# EAGLE design lightboxschematicv2 (EAGLE 9.2.0)
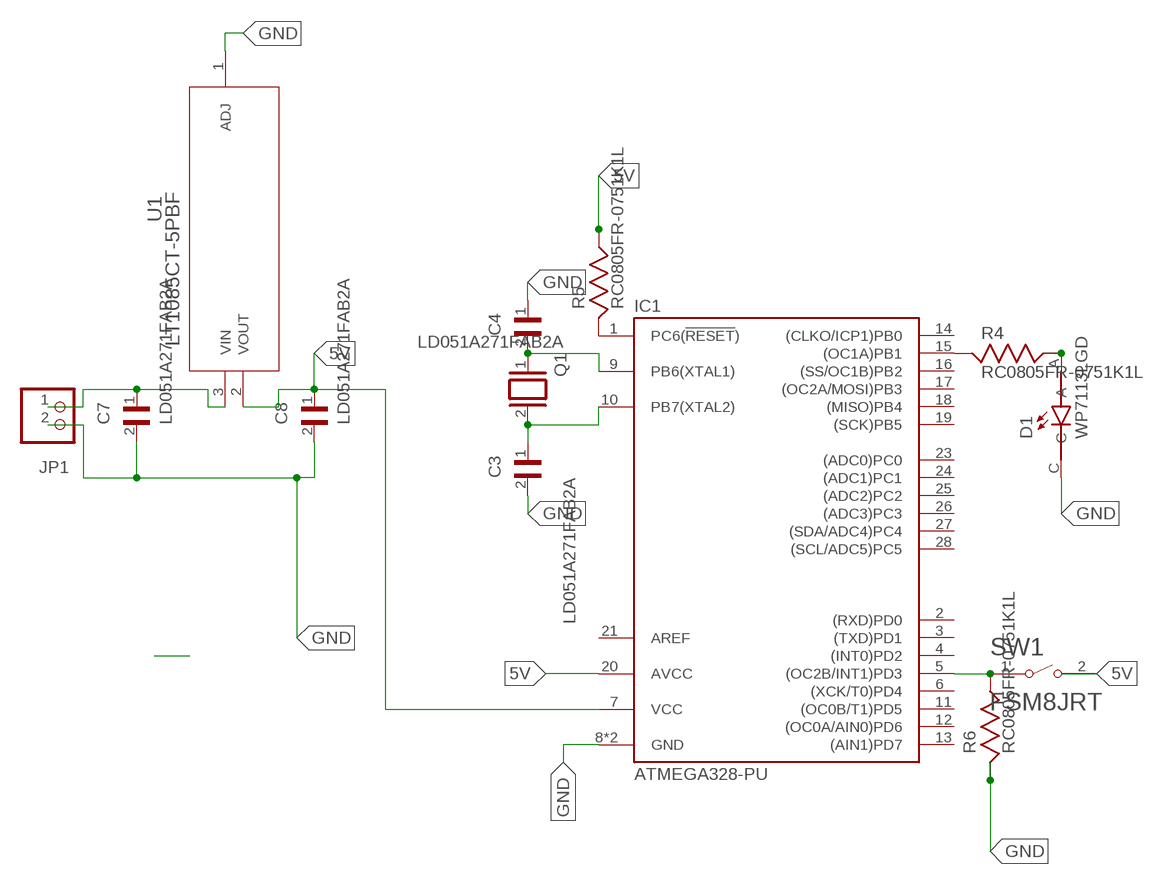
[diagram p0: schematic, sheet 1]

## Parts
C3  LD051A271FAB2A  [CAPC2012X140N]
C4  LD051A271FAB2A  [CAPC2012X140N]
C7  LD051A271FAB2A  [CAPC2012X140N]
C8  LD051A271FAB2A  [CAPC2012X140N]
D1  WP7113LGD  [LED_WP7113LGD]
IC1  ATMEGA328-PU  [DIL28]
JP1  PINHD-1X2  [1X02]
Q1  XTAL/S  [QS]
R4  RC0805FR-0751K1L  [RESC2012X60]
R5  RC0805FR-0751K1L  [RESC2012X60]
R6  RC0805FR-0751K1L  [RESC2012X60]
SW1  FSM8JRT  [TE_FSM8JRT]
U1  LT1085CT-5PBF  [TO220-3_T]

## Nets
5V: C8.1 IC1.7(VCC) IC1.20(AVCC) R5.2 SW1.2 U1.2(VOUT)
GND: C3.2 C4.1 C7.2 C8.2 D1.C IC1.8(GND) IC1.11((OC0B/T1)PD5) IC1.22(GND) JP1.2 R6.1 U1.1(ADJ)
N$1: IC1.1(PC6(!RESET!)) R5.1
N$2: D1.A R4.2
N$3: C7.1 JP1.1 U1.3(VIN)
N$4: IC1.5((OC2B/INT1)PD3) R6.2 SW1.1
N$5: IC1.15((OC1A)PB1) R4.1
N$6: C4.2 IC1.9(PB6(XTAL1)) Q1.1
N$7: C3.1 IC1.10(PB7(XTAL2)) Q1.2
Unconnected: IC1.2((RXD)PD0) IC1.3((TXD)PD1) IC1.4((INT0)PD2) IC1.6((XCK/T0)PD4) IC1.12((OC0A/AIN0)PD6) IC1.13((AIN1)PD7) IC1.14((CLKO/ICP1)PB0) IC1.16((SS/OC1B)PB2) IC1.17((OC2A/MOSI)PB3) IC1.18((MISO)PB4) IC1.19((SCK)PB5) IC1.21(AREF) IC1.23((ADC0)PC0) IC1.24((ADC1)PC1) IC1.25((ADC2)PC2) IC1.26((ADC3)PC3) IC1.27((SDA/ADC4)PC4) IC1.28((SCL/ADC5)PC5)

## Library data of the parts
C3 C4 C7 C8 = LD051A271FAB2A:LD051A271FAB2A: CAP CER 270PF 100V NP0 0805; AVAILABILITY: Unavailable; DESCRIPTION: Cap Ceramic 270pF 100V C0G 1% SMD 0805 125°C Paper T/R; MF: AVX; MP: LD051A271FAB2A; PACKAGE: 0805 AVX; PRICE: None
D1 = WP7113LGD:WP7113LGD: LED; Thru-Hole; Green; T1-3/4; 5mm; Clear Lens; 25ma; 565nm; 200mcd; Round; DESCRIPTION: LED; Thru-Hole; Green; T1-3/4; 5mm; Green Lens; 25mA; 565 nm; 2 mcd; Round; DIGI-KEY_PART_NUMBER: 754-1265-ND; DIGI-KEY_PURCHASE_URL: https://www.digikey.com/product-detail/en/kingbright/WP7113LGD/754-1265-ND/1747664?utm_source=snapeda&utm_medium=aggregator&utm_campaign=symbol; MF: Kingbright; MP: WP7113LGD; PACKAGE: Radial Kingbright
IC1 = ATMEGA328DIP-PU:ATMEGA328-PU: Atmel ATmega48/88/168/328 AVR Microcontroller; DESCRIPTION: ATmega Series 20 MHz 32 KB Flash 2 KB SRAM 8-Bit Microcontroller - DIP-28; DIGI-KEY_PART_NUMBER: ATMEGA328-PU-ND; DIGI-KEY_PURCHASE_URL: https://www.digikey.com/product-detail/en/microchip-technology/ATMEGA328-PU/ATMEGA328-PU-ND/2271026?utm_source=snapeda&utm_medium=aggregator&utm_campaign=symbol; MF: Microchip; MP: ATMEGA328-PU; PACKAGE: PDIP-28 Microchip
JP1 = pinhead:PINHD-1X2: PIN HEADER
Q1 = special:XTAL/S: CRYSTAL
R4-R6 = RC0805FR-0751K1L:RC0805FR-0751K1L: RC Series 0805 0.125 W 2 kOhms 5% ±100 ppm/°C SMT Thick Film Chip Resistor; DESCRIPTION: Res Thick Film 2.0 x 1.2 mm 51.1K Ohm 1% 0.125W_1/8W_ 100ppm/ C Molded SMD Paper T/R; DIGI-KEY_PART_NUMBER: 311-51.1KCRCT-ND; DIGI-KEY_PURCHASE_URL: https://www.digikey.com/product-detail/en/yageo/RC0805FR-0751K1L/311-51.1KCRCT-ND/730962?utm_source=snapeda&utm_medium=aggregator&utm_campaign=symbol; MF: Yageo; MP: RC0805FR-0751K1L; PACKAGE: 0805 Yageo
SW1 = FSM8JRT:FSM8JRT: Tactile Switches PUSHBUTTON SWITCH TACT; COMMENT: 147694-1; CONFIGURATION_POLE-THROW: Single Pole - Single Throw; CONTACT_CURRENT_RATING: 50 mA; DESCRIPTION: FSM8JRT=SWITCH,PUSHBUTTON,TACT; DIGI-KEY_PART_NUMBER: 450-2039-1-ND; DIGI-KEY_PURCHASE_URL: https://www.digikey.com/product-detail/en/te-connectivity-alcoswitch-switches/FSM8JRT/450-2039-1-ND/4146916?utm_source=snapeda&utm_medium=aggregator&utm_campaign=symbol; EU_ROHS_COMPLIANCE: Compliant; MF: TE Connectivity; MP: FSM8JRT; PACKAGE: None; TE_PURCHASE_URL: https://www.te.com/usa-en/product-147694-1.html?te_bu=Cor&te_type=disp&te_campaign=seda_glo_cor-seda-global-disp-prtnr-fy19-seda-model-bom-cta_sma-317_1&elqCampaignId=32493
U1 = VOLTAGEREGULATORNEW:LT1085CT-5PBF; MANUFACTURER_PART_NUMBER: LT1085CT5#PBF; VENDOR: Linear Technology

## Net classes
0 default: width 0.305 mm, drill 0.508 mm, clearance 0.305 mm

## Board
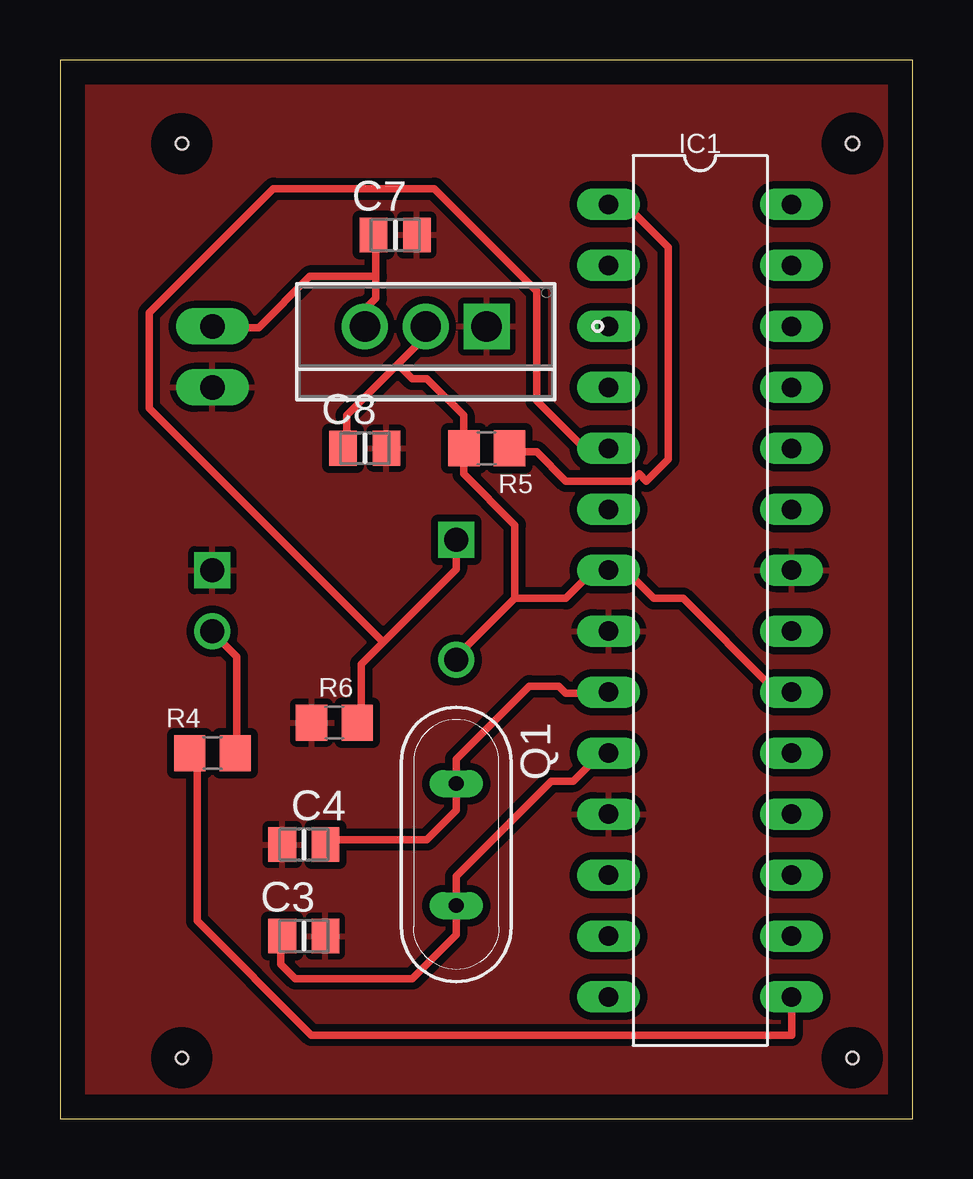
[diagram p1: board, top side]
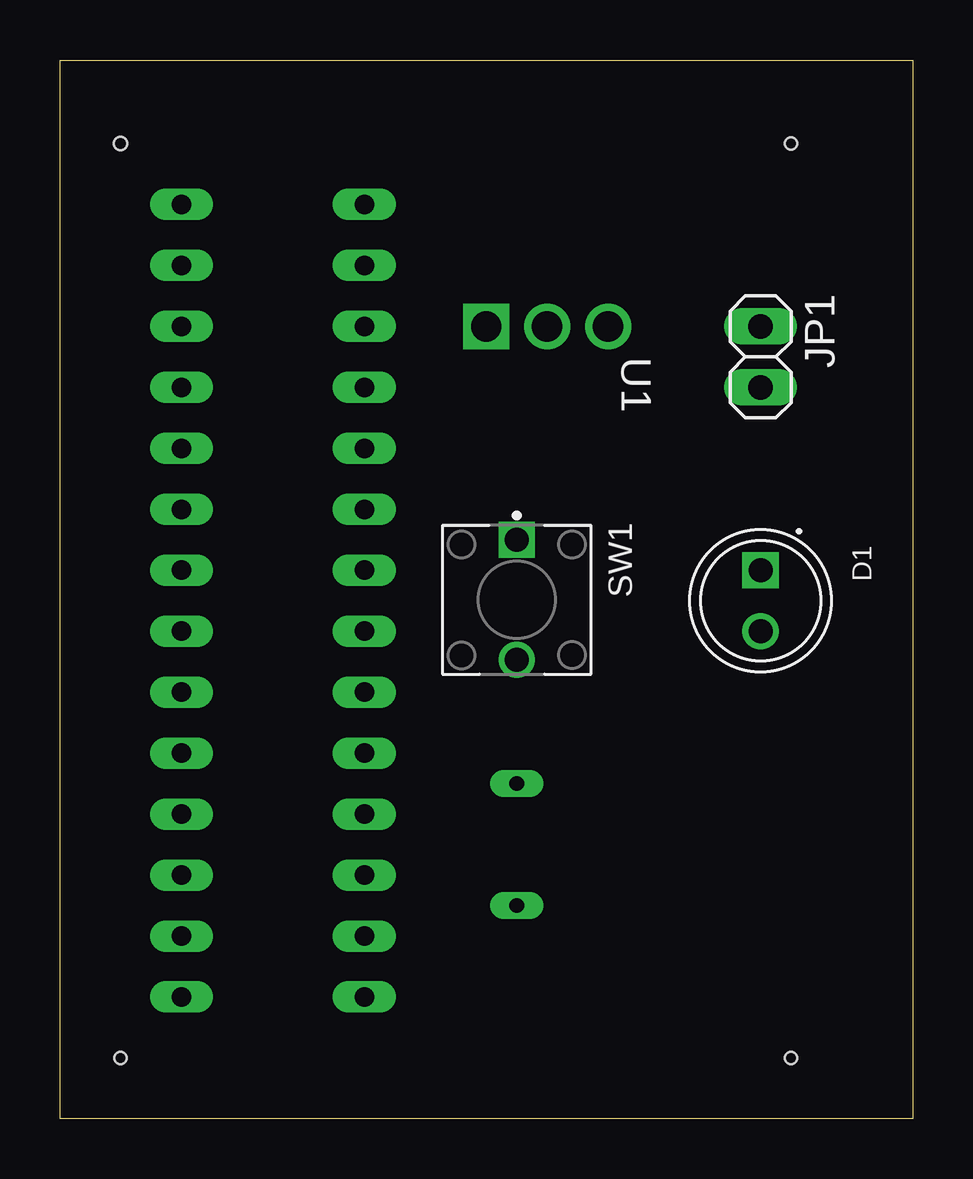
[diagram p2: board, bottom side, seen from below]

Size 35.54 x 44.12 mm. Coordinates in mm from the lower left corner, seen from the top.
Outline: 0,0 35.54,0 35.54,44.12 0,44.12 0,0
Copper layers (1*16): Top 0.035mm / dielectric 1.5mm / Bottom 0.035mm
Design rules "default": minimum track width 6mil, minimum drill 0.35mm, track to track 6mil, track to pad 6mil, pad to pad 6mil, via to via 6mil, smd to smd 6mil, copper to edge 40mil, drill to drill 6mil, minimum pad ring 10mil, minimum via ring 8mil, stop-mask expansion 4mil, vias tented up to drill 0mil, thermal gap 10mil
Holes 0.51 mm at 5.08,40.64 5.08,2.54 33.02,2.54
Holes 0.53 mm at 33.02,40.64

### Footprints (pad centres in the part's own frame; a part is rotated, then mirrored left to right if it is on the bottom)
CAPC2012X140N = smd 1.15 x 1.45: 1 -0.9,0; 2 0.9,0
LED_WP7113LGD = drill 1: A 1.27,0 | drill 1 square: C -1.27,0
DIL28 = drill 0.813 long: 1 -3.81,16.51; 2 -3.81,13.97; 3 -3.81,11.43; 4 -3.81,8.89; 5 -3.81,6.35; 6 -3.81,3.81; 7 -3.81,1.27; 8 -3.81,-1.27; 9 -3.81,-3.81; 10 -3.81,-6.35; 11 -3.81,-8.89; 12 -3.81,-11.43; 13 -3.81,-13.97; 14 -3.81,-16.51; 15 3.81,-16.51; 16 3.81,-13.97; 17 3.81,-11.43; 18 3.81,-8.89; 19 3.81,-6.35; 20 3.81,-3.81; 21 3.81,-1.27; 22 3.81,1.27; 23 3.81,3.81; 24 3.81,6.35; 25 3.81,8.89; 26 3.81,11.43; 27 3.81,13.97; 28 3.81,16.51
1X02 = drill 1.016 long: 1 -1.27,0; 2 1.27,0
QS = drill 0.61 long: 1 -2.54,0; 2 2.54,0
RESC2012X60 = smd 1.3 x 1.5: 1 -0.95,0; 2 0.95,0
TE_FSM8JRT = drill 0.991 square: 1 0,0 | drill 0.991: 2 5.004,0
TO220-3_T = drill 1.27 pad 1.778 square: 1 -5.08,-1.27 | drill 1.27 pad 1.778: 2 -2.54,-1.27; 3 0,-1.27

### Placement (x,y rotation side)
C3  10.16,7.62 0 top
C4  10.16,11.43 0 top
C7  13.97,36.83 0 top
C8  12.7,27.94 0 top
D1  6.35,21.59 270 bottom
IC1  26.67,21.59 0 top
JP1  6.35,31.75 270 bottom
Q1  16.51,11.43 270 top
R4  6.35,15.24 0 top
R5  17.78,27.94 180 top
R6  11.43,16.51 0 top
SW1  16.51,24.13 270 bottom
U1  12.7,31.75 180 top

### Tracks (layer width: path | path; a pad name or v marks a point on that pad's centre or on a via)
5V
  Top 0.305: 14.07,31.45 14.99,32.36 14.99,32.97 U1.2 | 14.07,31.45 11.94,29.31 11.94,28.09 C8.1 | 14.07,31.45 14.68,30.84 15.29,30.84 16.81,29.31 16.81,28.09 R5.2 16.81,27.79 16.81,26.87 18.95,24.74 18.95,21.69 | IC1.20 30.23,18.03 29.62,18.03 25.96,21.69 24.74,21.69 23.82,22.61 22.91,22.61 IC1.7 22.61,22.61 22,22.61 21.08,21.69 18.95,21.69 | 18.95,21.69 16.51,19.25 SW1.2
GND
  pour Top: -1.27,44.45 -1.27,0 36.83,0 36.83,45.72 -1.27,45.72
N$1
  Top 0.305: R5.1 18.95,27.79 19.86,27.79 21.08,26.57 23.82,26.57 24.13,26.87 24.44,26.57 25.35,27.48 25.35,36.32 23.82,37.85 22.91,37.85 IC1.1
N$2
  Top 0.305: R4.2 7.37,15.29 7.37,19.25 6.76,19.86 6.45,19.86 6.15,20.17 D1.A
N$3
  Top 0.305: 13.16,35.1 13.16,34.19 12.85,33.88 12.85,33.27 U1.3 | 13.16,35.1 13.16,36.63 C7.1 | 13.16,35.1 10.41,35.1 8.28,32.97 6.45,32.97 JP1.1
N$4
  Top 0.305: 13.46,19.86 16.51,22.91 SW1.1 | 13.46,19.86 12.55,18.95 12.55,16.51 R6.2 | 13.46,19.86 3.71,29.62 3.71,33.58 8.89,38.76 15.6,38.76 19.86,34.49 19.86,29.92 21.69,28.09 22.61,28.09 IC1.5
N$5
  Top 0.305: IC1.15 30.48,3.49 10.48,3.49 5.71,8.26 5.71,15.24 R4.1
N$6
  Top 0.305: C4.2 11.33,11.63 15.29,11.63 16.51,12.85 Q1.1 16.51,14.99 19.56,18.03 20.78,18.03 21.08,17.73 22.61,17.73 IC1.9
N$7
  Top 0.305: C3.1 9.2,7.37 9.2,6.45 9.8,5.84 14.68,5.84 16.51,7.67 Q1.2 16.51,10.11 20.47,14.07 21.39,14.07 22.3,14.99 22.61,14.99 IC1.10